# Altium project motherboard_PCB_Project.PrjPcb
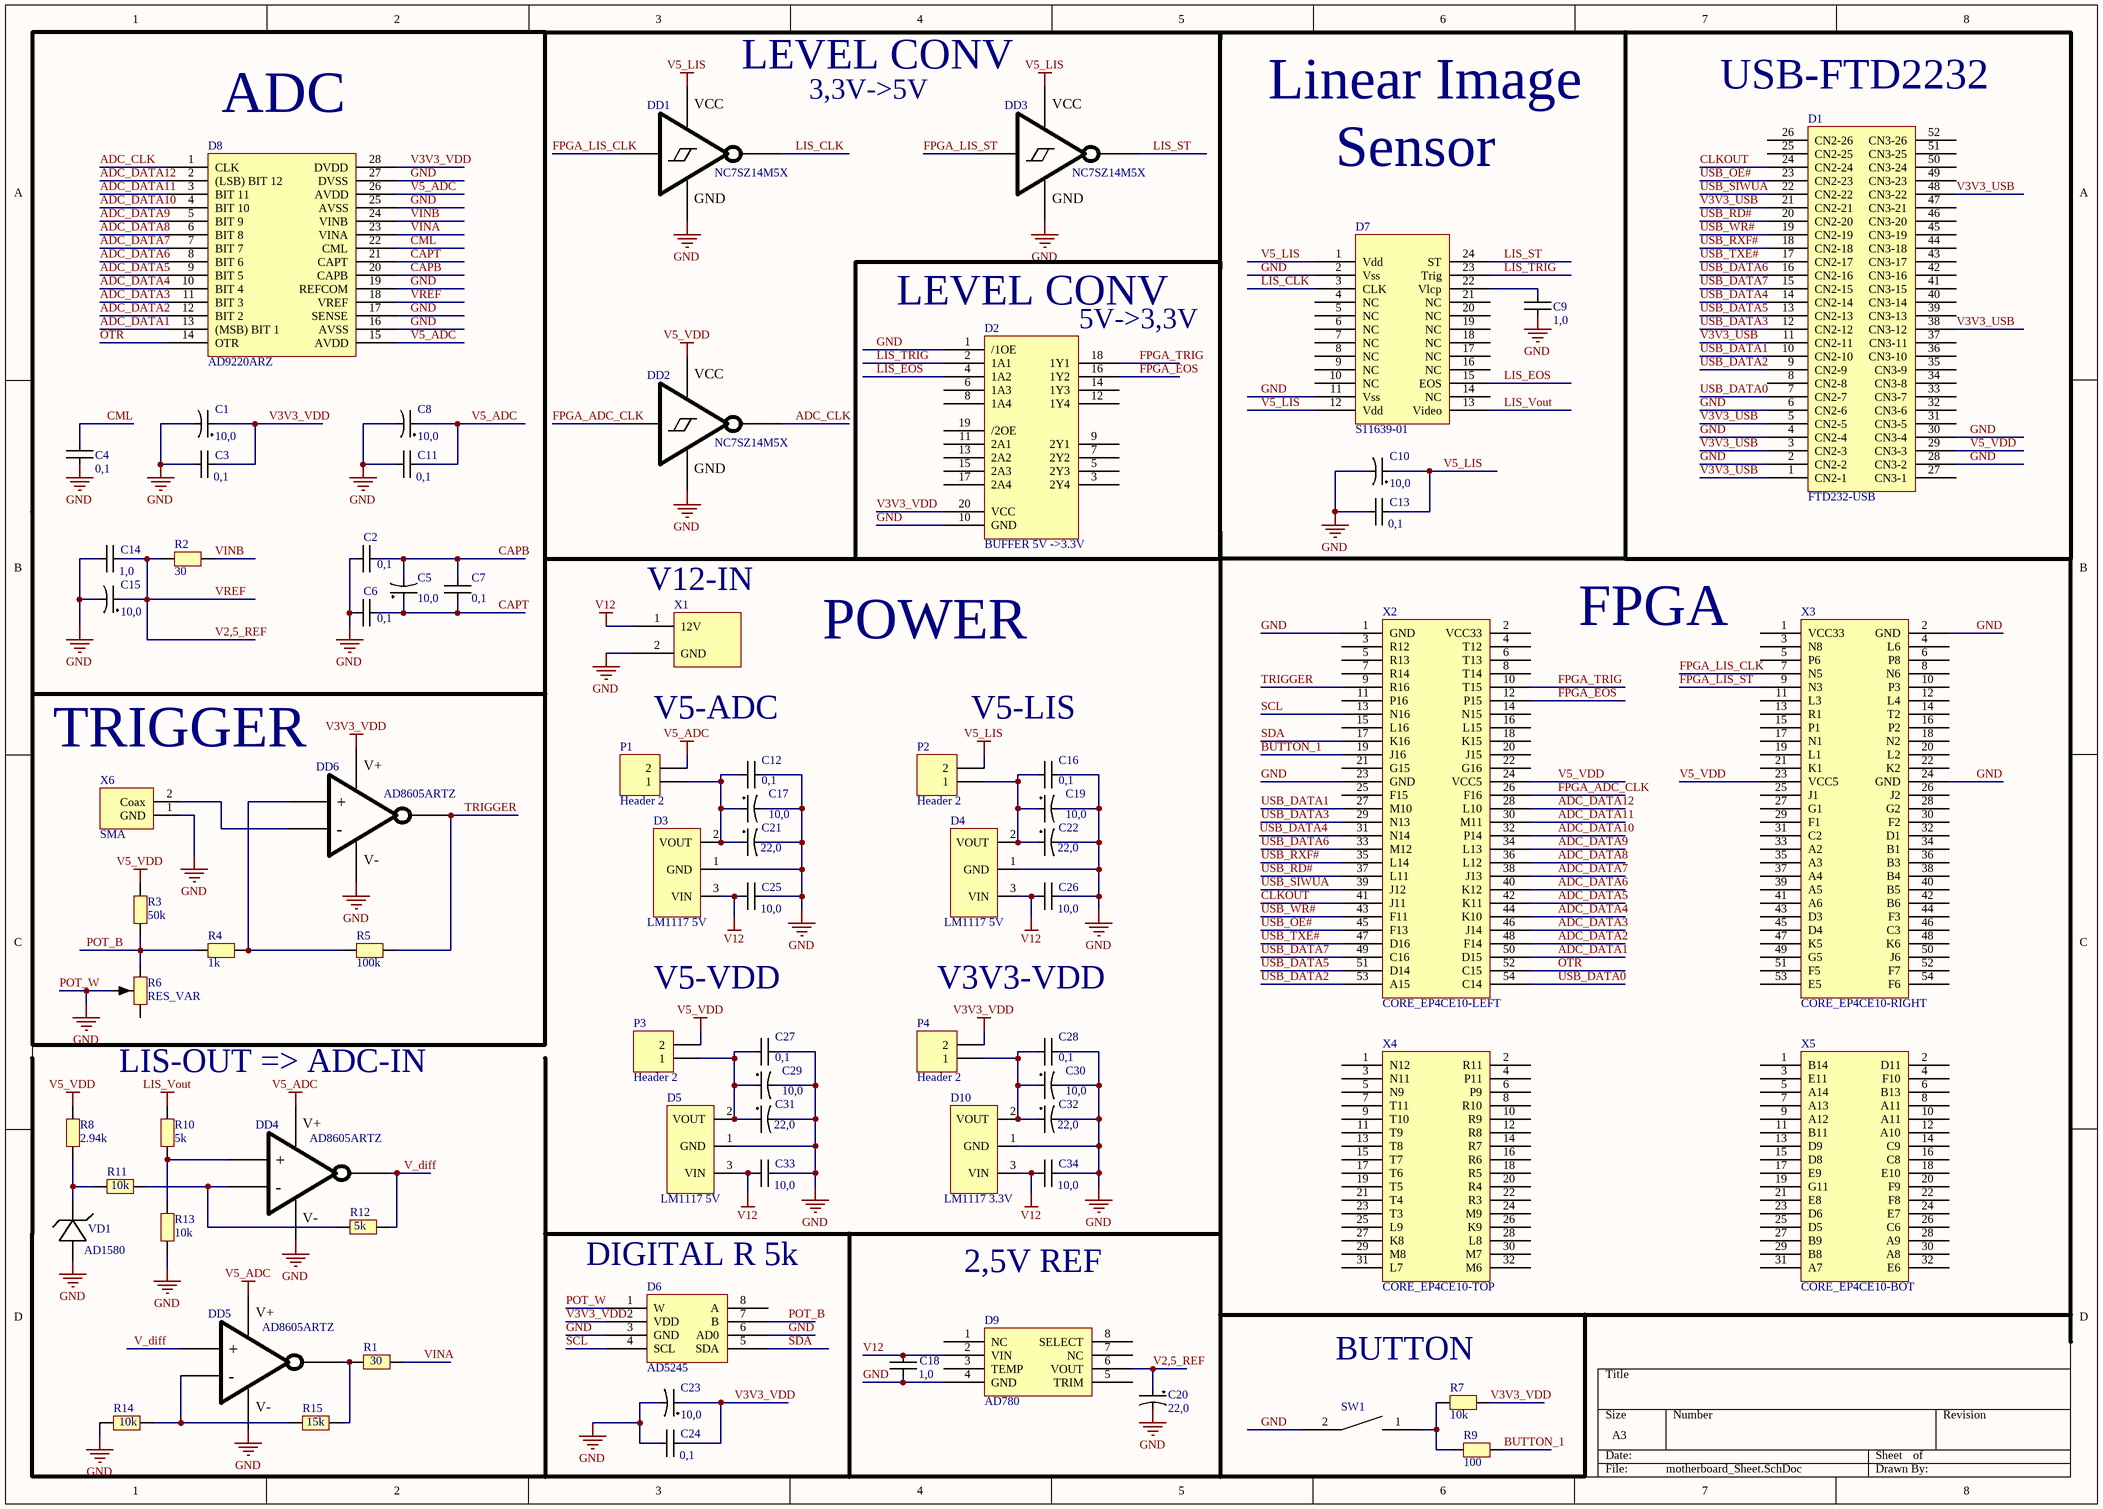
[diagram p0: motherboard_Sheet.SchDoc]
1 sheet, 77 parts. Net scope: global (net labels, ports and power ports of the same name join across sheets).
Board file: motherboard_PCB.PcbDoc

## Sheet motherboard_Sheet.SchDoc
size A3

### Parts
C1  10,0  [TYPE_C]
C2  0,1  [0805]
C3  0,1  [0805]
C4  0,1  [0805]
C5  10,0  [TYPE_C]
C6  0,1  [0805]
C7  0,1  [0805]
C8  10,0  [TYPE_C]
C9  1,0  [0805]
C10  10,0  [TYPE_C]
C11  0,1  [0805]
C12  0,1  [0805]
C13  0,1  [0805]
C14  1,0  [0805]
C15  10,0  [TYPE_C]
C16  0,1  [0805]
C17  10,0  [TYPE_C]
C18  1,0  [0805]
C19  10,0  [TYPE_C]
C20  22,0  [TYPE_C]
C21  22,0  [TYPE_C]
C22  22,0  [TYPE_C]
C23  10,0  [TYPE_C]
C24  0,1  [0805]
C25  10,0  [0805]
C26  10,0  [0805]
C27  0,1  [0805]
C28  0,1  [0805]
C29  10,0  [TYPE_C]
C30  10,0  [TYPE_C]
C31  22,0  [TYPE_C]
C32  22,0  [TYPE_C]
C33  10,0  [0805]
C34  10,0  [0805]
D1  FTD232-USB  [ftd232_minimodule]
D2  BUFFER 5V ->3.3V  [SN74LVC244ADWR]
D3  LM1117 5V  [TO-252]
D4  LM1117 5V  [TO-252]
D5  LM1117 5V  [TO-252]
D6  AD5245  [AD5245]
D7  S11639-01  [s11639-01]
D8  AD9220ARZ  [SOP28]
D9  AD780  [SOP8]
D10  LM1117 3.3V  [TO-252]
DD1  NC7SZ14M5X  [SOT-23-5]
DD2  NC7SZ14M5X  [SOT-23-5]
DD3  NC7SZ14M5X  [SOT-23-5]
DD4  AD8605ARTZ  [SOT-23-5]
DD5  AD8605ARTZ  [SOT-23-5]
DD6  AD8605ARTZ  [SOT-23-5]
P1  Header 2  [HDR1X2]
P2  Header 2  [HDR1X2]
P3  Header 2  [HDR1X2]
P4  Header 2  [HDR1X2]
R1  30  [0805]
R2  30  [0805]
R3  50k  [0805]
R4  1k  [0805]
R5  100k  [0805]
R6  RES_VAR  [3006P]
R7  10k  [0805]
R8  2.94k  [0805]
R9  100  [0805]
R10  5k  [0805]
R11  10k  [0805]
R12  5k  [0805]
R13  10k  [0805]
R14  10k  [0805]
R15  15k  [0805]
SW1  BUTTON  [BUTTON]  (value not drawn)
VD1  AD1580  [SOT-23]
X1  12V POWER  [Robiton-DS-210]  (value not drawn)
X2  CORE_EP4CE10-LEFT  [CORE_EP4CE10-LEFT]
X3  CORE_EP4CE10-RIGHT  [CORE_EP4CE10-RIGHT]
X4  CORE_EP4CE10-TOP  [CORE_EP4CE10-TOP]
X5  CORE_EP4CE10-BOT  [CORE_EP4CE10-BOT]
X6  SMA  [SMA]

### Nets
GND: C1.1 C2.2 C3.1 C4.1 C6.2 C8.1 C9.2 C10.1 C11.1 C12.1 C13.1 C14.1 C15.1 C16.1 C17.1 C18.1 C19.1 C20.1 C21.1 C22.1 C23.1 C24.1 C25.2 C26.2 C27.1 C28.1 C29.1 C30.1 C31.1 C32.1 C33.2 C34.2 D1.2(CN2-2) D1.4(CN2-4) D1.6(CN2-6) D1.28(CN3-2) D1.30(CN3-4) D2.1(/1OE) D2.10(GND) D3.1(GND) D4.1(GND) D5.1(GND) D6.1(W) D6.3(GND) D6.6(AD0) D7.2(Vss) D7.11(Vss) D8.16(AVSS) D8.17(SENSE) D8.19(REFCOM) D8.25(AVSS) D8.27(DVSS) D9.4(GND) D10.1(GND) DD1.3(GND) DD2.3(GND) DD3.3(GND) DD4.2(V-) DD5.2(V-) DD6.2(V-) R6.2 R13.2 R14.1 SW1.2 VD1.2(V-) X1.2(GND) X2.1(GND) X2.23(GND) X3.2(GND) X3.24(GND) X6.1(GND)  [also labelled POT_W]
LIS_Vout: D7.13(Video) R10.2
V3V3_VDD: C1.2 C3.2 C23.2 C24.2 D2.20(VCC) D6.2(VDD) D8.28(DVDD) DD6.5(V+) P4.2 R7.2
V5_ADC: C8.2 C11.2 D8.15(AVDD) D8.26(AVDD) DD4.5(V+) DD5.5(V+) P1.2
V5_LIS: C10.2 C13.2 D7.1(Vdd) D7.12(Vdd) DD1.5(VCC) DD3.5(VCC) P2.2
V5_VDD: D1.29(CN3-3) DD2.5(VCC) P3.2 R3.2 R8.2 X2.24(VCC5) X3.23(VCC5)
V12: C18.2 C25.1 C26.1 C33.1 C34.1 D3.3(VIN) D4.3(VIN) D5.3(VIN) D9.2(VIN) D10.3(VIN) X1.1(12V)
ADC_CLK: D8.1(CLK) DD2.4(Y_OUT)
ADC_DATA1: D8.13((MSB)_BIT_1) X2.50(D15)
ADC_DATA2: D8.12(BIT_2) X2.48(F14)
ADC_DATA3: D8.11(BIT_3) X2.46(J14)
ADC_DATA4: D8.10(BIT_4) X2.44(K10)
ADC_DATA5: D8.9(BIT_5) X2.42(K11)
ADC_DATA6: D8.8(BIT_6) X2.40(K12)
ADC_DATA7: D8.7(BIT_7) X2.38(J13)
ADC_DATA8: D8.6(BIT_8) X2.36(L12)
ADC_DATA9: D8.5(BIT_9) X2.34(L13)
ADC_DATA10: D8.4(BIT_10) X2.32(P14)
ADC_DATA11: D8.3(BIT_11) X2.30(M11)
ADC_DATA12: D8.2((LSB)_BIT_12) X2.28(L10)
BUTTON_1: R9.2 X2.19(J16)
CAPB: C2.1 C5.1 C7.2 D8.20(CAPB)
CAPT: C5.2 C6.1 C7.1 D8.21(CAPT)
CLKOUT: D1.24(CN2-24) X2.41(J11)
CML: C4.2 D8.22(CML)
FPGA_ADC_CLK: DD2.2(A_IN) X2.26(F16)
FPGA_EOS: D2.16(1Y2) X2.12(P15)
FPGA_LIS_CLK: DD1.2(A_IN) X3.7(N5)
FPGA_LIS_ST: DD3.2(A_IN) X3.9(N3)
FPGA_TRIG: D2.18(1Y1) X2.10(T15)
LIS_CLK: D7.3(CLK) DD1.4(Y_OUT)
LIS_EOS: D2.4(1A2) D7.15(EOS)
LIS_ST: D7.24(ST) DD3.4(Y_OUT)
LIS_TRIG: D2.2(1A1) D7.23(Trig)
OTR: D8.14(OTR) X2.52(C15)
POT_B: D6.7(B) R3.1 R4.2 R6.1
SCL: D6.4(SCL) X2.13(N16)
SDA: D6.5(SDA) X2.17(K16)
TRIGGER: DD6.1(OUT) R5.2 X2.9(R16)
USB_DATA0: D1.7(CN2-7) X2.54(C14)
USB_DATA1: D1.10(CN2-10) X2.27(M10)
USB_DATA2: D1.9(CN2-9) X2.53(A15)
USB_DATA3: D1.12(CN2-12) X2.29(N13)
USB_DATA4: D1.14(CN2-14) X2.31(N14)
USB_DATA5: D1.13(CN2-13) X2.51(D14)
USB_DATA6: D1.16(CN2-16) X2.33(M12)
USB_DATA7: D1.15(CN2-15) X2.49(C16)
USB_OE#: D1.23(CN2-23) X2.45(F13)
USB_RD#: D1.20(CN2-20) X2.37(L11)
USB_RXF#: D1.18(CN2-18) X2.35(L14)
USB_SIWUA: D1.22(CN2-22) X2.39(J12)
USB_TXE#: D1.17(CN2-17) X2.47(D16)
USB_WR#: D1.19(CN2-19) X2.43(F11)
V2,5_REF: C14.2 C15.2 C20.2 D8.18(VREF) D9.6(VOUT) R2.1  [also labelled VREF]
V3V3_USB: D1.1(CN2-1) D1.3(CN2-3) D1.5(CN2-5) D1.11(CN2-11) D1.21(CN2-21) D1.38(CN3-12) D1.48(CN3-22)
V_diff: DD4.1(OUT) DD5.3(+) R12.2
VINA: D8.23(VINA) R1.2
VINB: D8.24(VINB) R2.2
NetC9_1: C9.1 D7.22(Vlcp)
NetC12_2: C12.2 C17.2 C21.2 D3.2(VOUT) P1.1
NetC16_2: C16.2 C19.2 C22.2 D4.2(VOUT) P2.1
NetC27_2: C27.2 C29.2 C31.2 D5.2(VOUT) P3.1
NetC28_2: C28.2 C30.2 C32.2 D10.2(VOUT) P4.1
NetDD4_3: DD4.3(+) R10.1 R13.1
NetDD4_4: DD4.4(-) R11.2 R12.1
NetDD5_1: DD5.1(OUT) R1.1 R15.2
NetDD5_4: DD5.4(-) R14.2 R15.1
NetDD6_3: DD6.3(+) R4.1 R5.1
NetDD6_4: DD6.4(-) X6.2(Coax)
NetR7_1: R7.1 R9.1 SW1.1
NetR8_1: R8.1 R11.1 VD1.1(V+)

Not connected (* = marked no-connect by the designer): D1 8(CN2-8) 25(CN2-25) 26(CN2-26) 27(CN3-1) 31(CN3-5) 32(CN3-6) 33(CN3-7) 34(CN3-8) 35(CN3-9) 36(CN3-10) 37(CN3-11) 39(CN3-13) 40(CN3-14) 41(CN3-15) 42(CN3-16) 43(CN3-17) 44(CN3-18) 45(CN3-19) 46(CN3-20) 47(CN3-21) 49(CN3-23) 50(CN3-24) 51(CN3-25) 52(CN3-26); D2 3(2Y4) 5(2Y3) 6(1A3) 7(2Y2) 8(1A4) 9(2Y1) 11(2A1) 12(1Y4) 13(2A2) 14(1Y3) 15(2A3) 17(2A4) 19(/2OE); D6 8(A); D7 4(NC) 5(NC) 6(NC) 7(NC) 8(NC) 9(NC) 10(NC) 14(NC) 16(NC) 17(NC) 18(NC) 19(NC) 20(NC) 21(NC); D9 1(NC) 3(TEMP) 5(TRIM) 7(NC) 8(SELECT); R6 3; X2 2(VCC33) 3(R12) 4(T12) 5(R13) 6(T13) 7(R14) 8(T14) 11(P16) 14(N15) 15(L16) 16(L15) 18(K15) 20(J15) 21(G15) 22(G16) 25(F15); X3 1(VCC33) 3(N8) 4(L6) 5(P6) 6(P8) 8(N6) 10(P3) 11(L3) 12(L4) 13(R1) 14(T2) 15(P1) 16(P2) 17(N1) 18(N2) 19(L1) 20(L2) 21(K1) 22(K2) 25(J1) 26(J2) 27(G1) 28(G2) 29(F1) 30(F2) 31(C2) 32(D1) 33(A2) 34(B1) 35(A3) 36(B3) 37(A4) 38(B4) 39(A5) 40(B5) 41(A6) 42(B6) 43(D3) 44(F3) 45(D4) 46(C3) 47(K5) 48(K6) 49(G5) 50(J6) 51(F5) 52(F7) 53(E5) 54(F6); X4 1(N12) 2(R11) 3(N11) 4(P11) 5(N9) 6(P9) 7(T11) 8(R10) 9(T10) 10(R9) 11(T9) 12(R8) 13(T8) 14(R7) 15(T7) 16(R6) 17(T6) 18(R5) 19(T5) 20(R4) 21(T4) 22(R3) 23(T3) 24(M9) 25(L9) 26(K9) 27(K8) 28(L8) 29(M8) 30(M7) 31(L7) 32(M6); X5 1(B14) 2(D11) 3(E11) 4(F10) 5(A14) 6(B13) 7(A13) 8(A11) 9(A12) 10(A11) 11(B11) 12(A10) 13(D9) 14(C9) 15(D8) 16(C8) 17(E9) 18(E10) 19(G11) 20(F9) 21(E8) 22(F8) 23(D6) 24(E7) 25(D5) 26(C6) 27(B9) 28(A9) 29(B8) 30(A8) 31(A7) 32(E6)

### Notes on the sheet
- LEVEL CONV
- 3,3V->5V
- Linear Image
- (near D1) USB-FTD2232
- (near D8) ADC
- Sensor
- (near D2) LEVEL CONV
- (near D2) 5V->3,3V
- (near X1) V12-IN
- POWER
- FPGA
- V5-ADC
- V5-LIS
- (near X6) TRIGGER
- V5-VDD
- V3V3-VDD
- LIS-OUT => ADC-IN
- (near D6) DIGITAL R 5k
- 2,5V REF
- (near R7) BUTTON

### Library data of the parts
C1 C5 C8 C10 C15 C17 C19-C23 C29-C32 = CAP_TANT: SMD
C2-C4 C6 C7 C9 C11-C14 C16 C18 C24-C28 C33 C34 = CAP_SMALL: 0805
D1 = ftd232_minimodule
D2 = SN74LVC244ADWR
D3-D5 D10 = LM1117_FIX: LM1117-FIX
P1-P4 = Header 2: Header, 2-Pin; LatestRevisionDate: 17-Jul-2002; LatestRevisionNote: Re-released for DXP Platform.; Publisher: Altium Limited
R1-R5 R7-R15 = RES0805: 0805
R6 = RES_VAR: PV36W102C (СП5-2ВБ) 1 кОм
X1 = ROBITON_12V